# Altium schematic sheet RFID_Reader_Writer.SchDoc: RFID Reader Writer
size A3; Author: NK; CompanyName: Reichle & De-Massari; Organization: Reichle & De-Massari; Address1: Binzstrasse 32; Address2: 8620 Wetzikon; Address3: Switzerland; DocumentNumber: 4; Revision: V0.2; SheetNumber: 1; SheetTotal: 5; Organization1: Reichle & De-Massari; Size: A4; ShortDescription: MCU and RFID Reader
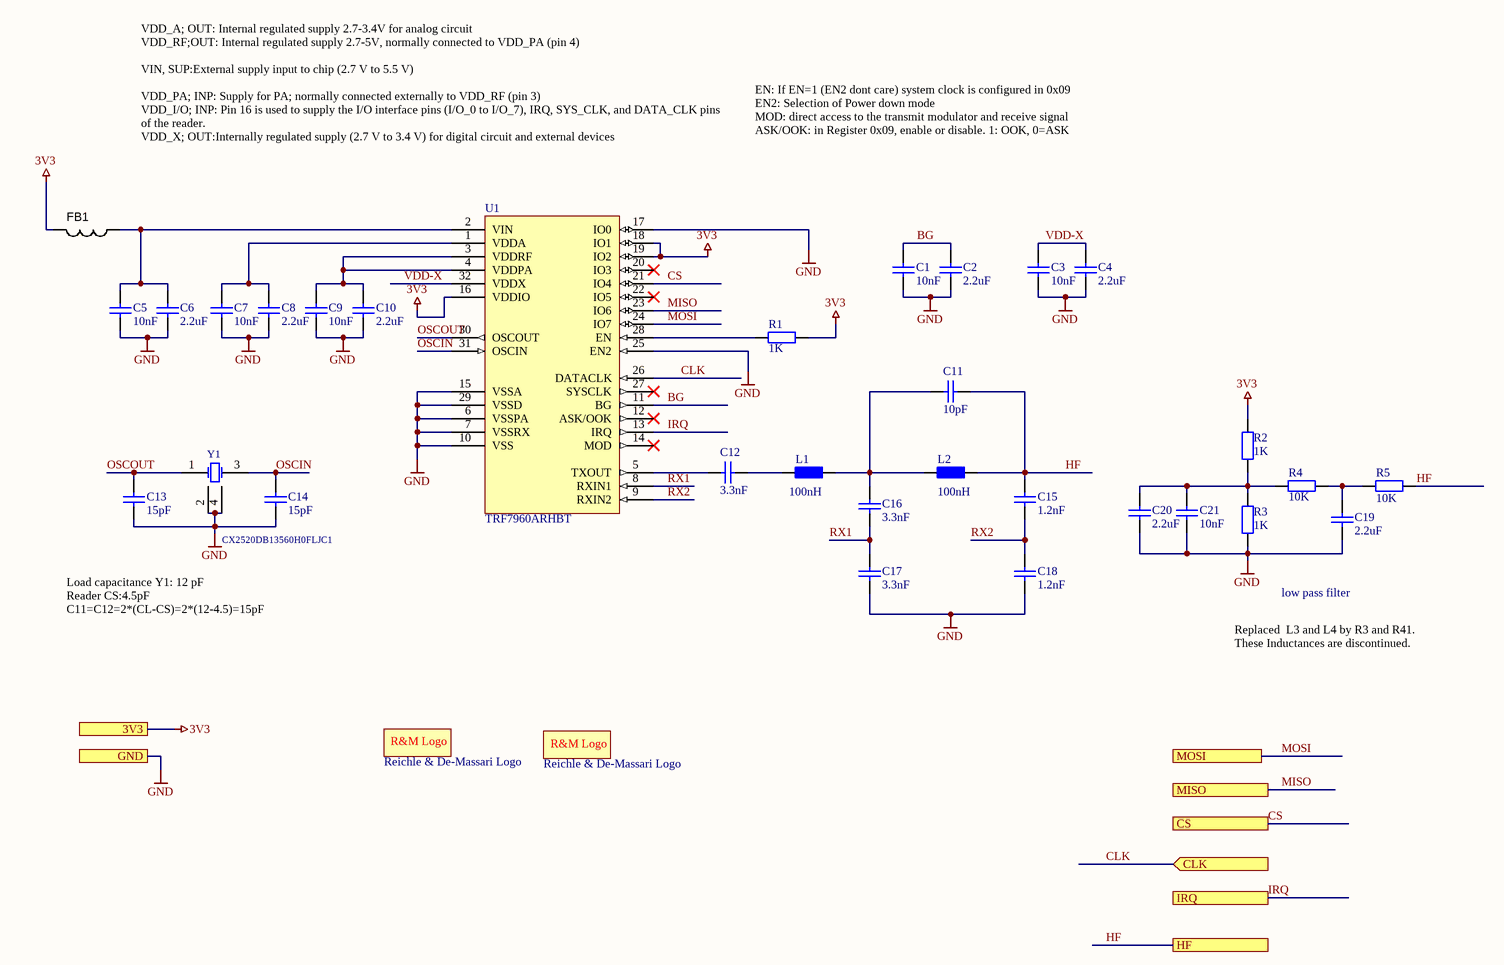
[diagram p0: RFID_Reader_Writer.SchDoc]

## Parts
*1  Reichle & De-Massari Logo  [SYMBOL_R&M]  (no BOM)
*2  Reichle & De-Massari Logo  [SYMBOL_R&M]  (net tie)
C1  10nF  [Ceramic Capacitor 0402 EIA]
C2  2.2uF  [Ceramic Capacitor 0402 EIA]
C3  10nF  [Ceramic Capacitor 0402 EIA]
C4  2.2uF  [Ceramic Capacitor 0402 EIA]
C5  10nF  [Ceramic Capacitor 0402 EIA]
C6  2.2uF  [Ceramic Capacitor 0402 EIA]
C7  10nF  [Ceramic Capacitor 0402 EIA]
C8  2.2uF  [Ceramic Capacitor 0402 EIA]
C9  10nF  [Ceramic Capacitor 0402 EIA]
C10  2.2uF  [Ceramic Capacitor 0402 EIA]
C11  10pF  [Ceramic Capacitor 0402 EIA]
C12  3.3nF  [Ceramic Capacitor 0402 EIA]
C13  15pF  [Ceramic Capacitor 0402 EIA]
C14  15pF  [Ceramic Capacitor 0402 EIA]
C15  1.2nF  [Ceramic Capacitor 0402 EIA]
C16  3.3nF  [Ceramic Capacitor 0402 EIA]
C17  3.3nF  [Ceramic Capacitor 0402 EIA]
C18  1.2nF  [Ceramic Capacitor 0402 EIA]
C19  2.2uF  [Ceramic Capacitor 0402 EIA]
C20  2.2uF  [Ceramic Capacitor 0402 EIA]
C21  10nF  [Ceramic Capacitor 0402 EIA]
FB1  BK1005HS102-T  [CAPC1005X55N]  (value not drawn)
L1  value 100nH  [Inductor 0603 EIA]  (hidden comment: HK1608R10J-T)
L2  value 100nH  [Inductor 0603 EIA]  (hidden comment: HK1608R10J-T)
R1  1K  [Resistor 0402 EIA]
R2  1K  [Resistor 0402 EIA]
R3  1K  [Resistor 0402 EIA]
R4  10K  [Resistor 0402 EIA]
R5  10K  [Resistor 0402 EIA]
U1  TRF7960ARHBT  [TexasInstruments_32-VFQFN_32_R]
Y1  CX2520DB13560H0FLJC1  [AVX/Kyocera_DFN4_4_RWH]

## Ports
3V3, CLK (in), CS, GND, HF, IRQ, MISO, MOSI

## Nets
3V3: FB1.2 R1.2 R2.1 U1.16(VDDIO) U1.18(IO1) U1.19(IO2) ; port 3V3
GND: C1.1 C2.1 C3.1 C4.1 C5.1 C6.1 C7.1 C8.1 C9.1 C10.1 C13.1 C14.1 C17.1 C18.1 C19.1 C20.1 C21.1 R3.2 U1.6(VSSPA) U1.7(VSSRX) U1.10(VSS) U1.15(VSSA) U1.17(IO0) U1.25(EN2) U1.29(VSSD) Y1.2(OSC2) Y1.4(OSC3) ; port GND
BG: C1.2 C2.2 U1.11(BG)
CLK: U1.26(DATACLK) ; port CLK
CS: U1.21(IO4) ; port CS
HF: C11.1 C15.2 L2.2 R5.2 ; port HF
IRQ: U1.13(IRQ) ; port IRQ
MISO: U1.23(IO6) ; port MISO
MOSI: U1.24(IO7) ; port MOSI
OSCIN: C14.2 U1.31(OSCIN) Y1.3(OSC2)
OSCOUT: C13.2 U1.30(OSCOUT) Y1.1(OSC1)
RX1: C16.1 C17.2 U1.8(RXIN1)
RX2: C15.1 C18.2 U1.9(RXIN2)
VDD-X: C3.2 C4.2 U1.32(VDDX)
NetC5_2: C5.2 C6.2 FB1.1 U1.2(VIN)
NetC7_2: C7.2 C8.2 U1.1(VDDA)
NetC9_2: C9.2 C10.2 U1.3(VDDRF) U1.4(VDDPA)
NetC11_2: C11.2 C16.2 L1.2 L2.1
NetC12_1: C12.1 L1.1
NetC12_2: C12.2 U1.5(TXOUT)
NetC19_2: C19.2 R4.2 R5.1
NetC20_2: C20.2 C21.2 R2.2 R3.1 R4.1
NetR1_1: R1.1 U1.28(EN)

Not connected (* = marked no-connect by the designer): U1 12(ASK/OOK)* 14(MOD)* 20(IO3)* 22(IO5)* 27(SYSCLK)*

## Notes on the sheet
- VDD_A; OUT: Internal regulated supply 2.7-3.4V for analog circuit
  VDD_RF;OUT: Internal regulated supply 2.7-5V, normally connected to VDD_PA (pin 4)
  VIN, SUP:External supply input to chip (2.7 V to 5.5 V)
  VDD_PA; INP: Supply for PA; normally connected externally to VDD_RF (pin 3)
  VDD_I/O; INP: Pin 16 is used to supply the I/O interface pins (I/O_0 to I/O_7), IRQ, SYS_CLK, and DATA_CLK pins of the reader.
  VDD_X; OUT:Internally regulated supply (2.7 V to 3.4 V) for digital circuit and external devices
- EN: If EN=1 (EN2 dont care) system clock is configured in 0x09
  EN2: Selection of Power down mode
  MOD: direct access to the transmit modulator and receive signal
  ASK/OOK: in Register 0x09, enable or disable. 1: OOK, 0=ASK
- Load capacitance Y1: 12 pF
  Reader CS:4.5pF
  C11=C12=2*(CL-CS)=2*(12-4.5)=15pF
- Replaced  L3 and L4 by R3 and R41. These Inductances are discontinued.
- low pass filter
- Title
- Size:
- Date:
- A3
- Number:
- Time:
- Revision:
- Sheet
- of
- File:
- (in symbol SYMBOL_R&M) R&M Logo

## Library data of the parts
*1 = SYMBOL_R&M: Replaceable: no; Footprint/Package: 2.54mm
*2 = SYMBOL_R&M: Replaceable: no; value: Overlay; Footprint/Package: 2.54mm
C1 C3 C5 C7 C9 C21 = Cap_10nF_0402: 10000pF ±10% 50V Keramikkondensatoren X7R 0402 (1005 metrisch) CL05B103KB5NNNC; Manufacturer: Samsung Electro-Mechanics; voltage: 50 VDC; Replaceable: yes; value: 10nF; tolerance: ±10%; ComponentLink1Description: mouser; ComponentLink1URL: https://www.mouser.ch/ProductDetail/Murata-Electronics/ZRB15XR61A106ME01D?qs=sGAEpiMZZMs0AnBnWHyRQN7%2fAA2D2lPPC0%2fdyv23S%2fU%252bBeuYI5b1UA%3d%3d; Manufacturer PartNr: CL05B103KB5NNNC; Footprint/Package: 0402; Dielectric Grade: X7R; Supplier 1: Digi-Key; Supplier Part Number 1: 1276-1028-1-ND
C2 C4 C6 C8 C10 = Cap_2.2uF_0402: Multilayer Ceramic Capacitors MLCC - SMD/SMT 0402 2.2uF 6.3volts *Derate Voltage/Temp, 2.2µF ±20% 25V Ceramic Capacitor X5R 0402 (1005 Metric); Manufacturer: Murata; Manufacturer PartNr: GRM155R60J225ME15D; voltage: 6,3V; Replaceable: yes; value: 2.2uF; tolerance: ±20%; Dielectric Grade: X5R; Footprint/Package: 0402; ComponentLink1Description: digikey; ComponentLink1URL: https://www.digikey.com/product-detail/en/murata-electronics-north-america/GRM155R61E225ME15D/490-10457-2-ND/5027542; Supplier 1: Digi-Key; Supplier Part Number 1: 490-4519-1-ND
C11 = Cap_10pF_0402: Multilayer Ceramic Capacitors MLCC - SMD/SMT 0402 10pF 50Volts C0G 1%; Manufacturer: Murata; Manufacturer PartNr: GJM1555C1H100FB01D; voltage: 50 VDC; Replaceable: yes; value: 10pF; tolerance: ±1%; Dielectric Grade: C0G; Footprint/Package: 0402; ComponentLink1Description: digikey; ComponentLink1URL: https://www.digikey.com/product-detail/en/murata-electronics-north-america/GRM155R61E225ME15D/490-10457-2-ND/5027542; Supplier 1: Mouser; Supplier Part Number 1: 81-GJM1555C1H100FB01
C12 C16 C17 = Cap_3.3nF_0402: Multilayer Ceramic Capacitors MLCC - SMD/SMT 0402 3300pF 50volts X7R 5%; Manufacturer: Murata; Manufacturer PartNr: GCM155R71H332JA37D; voltage: 50 VDC; Replaceable: yes; value: 3.3nF; tolerance: ±5%; Dielectric Grade: X7R; Footprint/Package: 0402; ComponentLink1Description: digikey; ComponentLink1URL: https://www.digikey.com/product-detail/en/murata-electronics-north-america/GRM155R61E225ME15D/490-10457-2-ND/5027542; Supplier 1: Digi-Key; Supplier Part Number 1: 490-16426-1-ND
C13 C14 = Cap_15pF_0402: Multilayer Ceramic Capacitors MLCC - SMD/SMT 0402 15pF 50Volts C0G 5%, Multilayer Ceramic Capacitors MLCC; Manufacturer: Murata; Manufacturer PartNr: GJM1555C1H150FB01D; tolerance: ±1%; voltage: 50 VDC; Replaceable: yes; value: 15pF; ComponentLink1Description: mouser; ComponentLink1URL: https://www.mouser.ch/ProductDetail/Murata-Electronics/ZRB15XR61A106ME01D?qs=sGAEpiMZZMs0AnBnWHyRQN7%2fAA2D2lPPC0%2fdyv23S%2fU%252bBeuYI5b1UA%3d%3d; Footprint/Package: 0402; Dielectric Grade: C0G; Supplier 1: Digi-Key; Supplier Part Number 1: 490-11191-1-ND
C15 C18 = Cap_1.2nF_0402: Multilayer Ceramic Capacitors MLCC - SMD/SMT 50V 1200pF C0G 0402 5%; Manufacturer: Kemet; Manufacturer PartNr: C0402C122J5GACTU; voltage: 50 VDC; Replaceable: yes; value: 1.2nF; tolerance: ±5%; ComponentLink1Description: mouser; ComponentLink1URL: https://www.mouser.ch/ProductDetail/Murata-Electronics/ZRB15XR61A106ME01D?qs=sGAEpiMZZMs0AnBnWHyRQN7%2fAA2D2lPPC0%2fdyv23S%2fU%252bBeuYI5b1UA%3d%3d; Footprint/Package: 0402; Dielectric Grade: C0G; Supplier 1: Digi-Key; Supplier Part Number 1: 399-7334-1-ND
C19 C20 = Cap_2.2uF_0402_6.3V: Multilayer Ceramic Capacitors MLCC - SMD/SMT 0402 2.2uF 6.3volts; Manufacturer: Murata; Manufacturer PartNr: GRM155R60J225ME15D; tolerance: 20%; voltage: 6.3V; Replaceable: yes; Dielectric Grade: X5R; value: 2.2uF; Footprint/Package: 0402 (1005 metric); Supplier 1: Mouser; Supplier Part Number 1: 81-GRM155R60J225ME5D
FB1 = FERRITE_2K2-100MHz_0603: FERRITE BEAD 1 KOHM 0402 1LN; Manufacturer: Taiyo Yuden; Manufacturer PartNr: BK1005HS102-T
L1 L2 = 706xx_R+M_InteliPhyII_KTI-00029-A.1: 100nH Unshielded Multilayer Inductor 300mA 100 mOhm Max 0603 (1608 Metric); Manufacturer: Taiyo Yuden; Manufacturer PartNr: HK1608R10J-T
R1-R3 = Res_1K_0402: RES SMD 1K OHM 1% 1/16W 0402; Manufacturer: Yageo; Manufacturer PartNr: RC0402FR-071KL; power: 0,063W, 1/16W; Replaceable: yes; value: 1K; tolerance: ±1%; Footprint/Package: 0402 (1005 metric); Supplier 1: Digi-Key; Supplier Part Number 1: 311-1.00KLRCT-ND
R4 R5 = Res_10K_0402: SMD 10K ohm 1% 50V General Purpose; Manufacturer: Yageo; Manufacturer PartNr: RC0402FR-1010KL; power: 63mW; Replaceable: yes; value: 10K; tolerance: 1%; ComponentLink1Description: mouser; ComponentLink1URL: https://www.mouser.ch/ProductDetail/Yageo/RC0402FR-1010KL?qs=sGAEpiMZZMtlubZbdhIBIEgN9MQql2m6Sb2LnYlCICU%3d; Footprint/Package: 0402; Supplier 1: Mouser; Supplier Part Number 1: 603-RC0402FR-1010KL
U1 = TexasInstruments_TRF7960ARHBT_32-VFQFN_32: Manufacturer: Texas Instruments; Manufacturer PartNr: TRF7960ARHBT
Y1 = CRYSTAL_4Pin_1_3_1: 13.56MHz ±10ppm Crystal 12pF 150 Ohms 4-SMD, No Lead; Manufacturer: Kyocera International Inc. Electronic Components; Manufacturer PartNr: CX2520DB13560H0FLJC1